# Altium schematic sheet Sheet_X_link.SchDoc
size A4
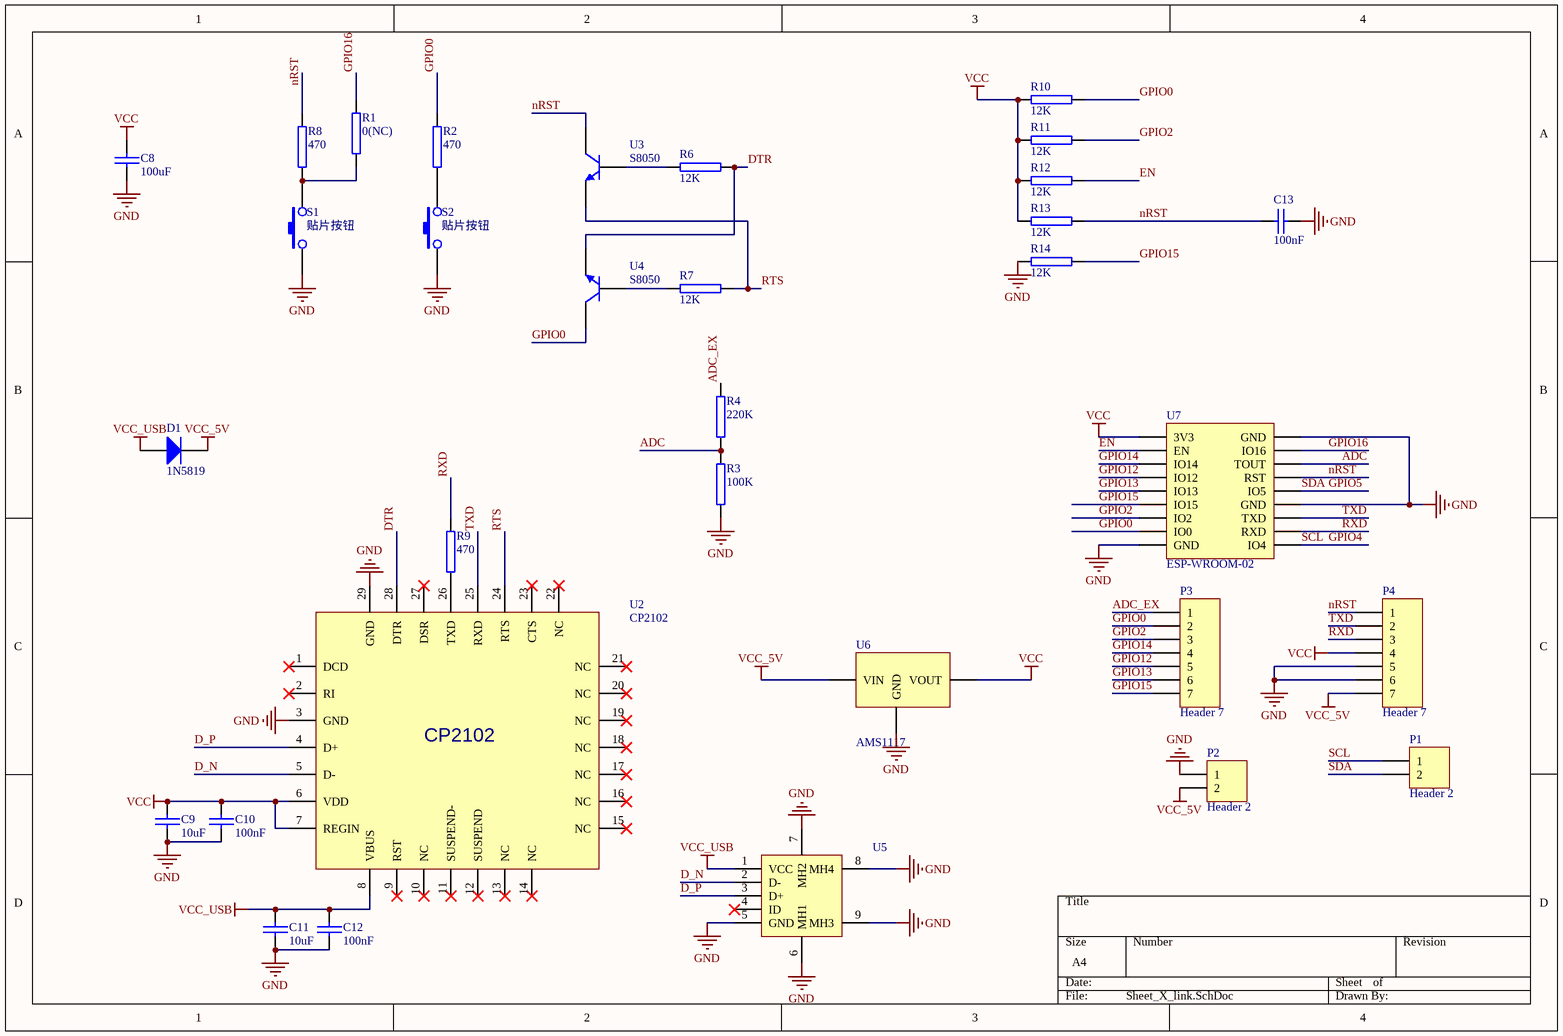
[diagram p0: Sheet_X_link.SchDoc]

## Parts
C8  100uF  [C3528]
C9  10uF  [C0603]
C10  100nF  [C0603]
C11  10uF  [C0603]
C12  100nF  [C0603]
C13  100nF  [C0603]
D1  1N5819  [1n4148]
P1  Header 2  [HDR1X2]
P2  Header 2  [HDR1X2]
P3  Header 7  [HDR1X7]
P4  Header 7  [HDR1X7]
R1  0(NC)  [R0603]
R2  470  [R0603]
R3  100K  [R0603]
R4  220K  [R0603]
R6  12K  [R0603]
R7  12K  [R0603]
R8  470  [R0603]
R9  470  [R0603]
R10  12K  [R0603]
R11  12K  [R0603]
R12  12K  [R0603]
R13  12K  [R0603]
R14  12K  [R0603]
S1  贴片按钮  [switch]
S2  贴片按钮  [switch]
U2  CP2102  [cp2102]
U3  S8050  [s8050]
U4  S8050  [s8050]
U5  MicroUSB-5P  [MICROUSB_5S]  (value not drawn)
U6  AMS1117  [AMS1117]
U7  ESP-WROOM-02  [ESP-WROOM-02]

## Nets
GND: C8.2 C9.1 C10.1 C11.1 C12.1 C13.2 P2.1 P4.5 P4.6 R3.1 R14.1 S1.1 S2.1 U2.3(GND) U2.29(GND) U5.5(GND) U5.6(MH1) U5.7(MH2) U5.8(MH4) U5.9(MH3) U6.1(GND) U7.8(GND) U7.12(GND) U7.17(GND)
VCC: C8.1 C9.2 C10.2 P4.4 R10.1 R11.1 R12.1 R13.1 U2.6(VDD) U2.7(REGIN) U6.2(VOUT) U7.0(3V3)
VCC_5V: D1.2(K) P2.2 P4.7 U6.3(VIN)
VCC_USB: C11.2 C12.2 D1.1(A) U2.8(VBUS) U5.1(VCC)
ADC: R3.2 R4.1 U7.15(TOUT)
ADC_EX: P3.1 R4.2
D_N: U2.5(D-) U5.2(D-)
D_P: U2.4(D+) U5.3(D+)
DTR: R6.2 U2.28(DTR) U4.2(E)
EN: R12.2 U7.1(EN)
GPIO0: P3.2 R2.2 R10.2 U4.3(C) U7.7(IO0)
GPIO2: P3.3 R11.2 U7.6(IO2)
GPIO4: P1.1 U7.9(IO4)  [also labelled SCL]
GPIO5: P1.2 U7.13(IO5)  [also labelled SDA]
GPIO12: P3.5 U7.3(IO12)
GPIO13: P3.6 U7.4(IO13)
GPIO14: P3.4 U7.2(IO14)
GPIO15: P3.7 R14.2 U7.5(IO15)
GPIO16: R1.2 U7.16(IO16)
nRST: C13.1 P4.1 R8.2 R13.2 U3.3(C) U7.14(RST)
RTS: R7.2 U2.24(RTS) U3.2(E)
RXD: P4.3 R9.2 U7.10(RXD)
TXD: P4.2 U2.25(RXD) U7.11(TXD)
NetR1_1: R1.1 R8.1 S1.2
NetR2_1: R2.1 S2.2
NetR6_1: R6.1 U3.1(B)
NetR7_1: R7.1 U4.1(B)
NetR9_1: R9.1 U2.26(TXD)

Not connected (* = marked no-connect by the designer): U2 1(DCD)* 2(RI)* 9(RST)* 10(NC)* 11(SUSPEND-)* 12(SUSPEND)* 13(NC)* 14(NC)* 15(NC)* 16(NC)* 17(NC)* 18(NC)* 19(NC)* 20(NC)* 21(NC)* 22(NC)* 23(CTS)* 27(DSR)*; U5 4(ID)*

## Library data of the parts
C8-C13 = C0603: 贴片电容
D1 = 1N4148: 二极管
P1 P2 = Header 2: Header, 2-Pin; LatestRevisionDate: 17-Jul-2002; LatestRevisionNote: Re-released for DXP Platform.; Publisher: Altium Limited
P3 P4 = Header 7: Header, 7-Pin; LatestRevisionDate: 17-Jul-2002; LatestRevisionNote: Re-released for DXP Platform.; Publisher: Altium Limited
R1-R4 R6-R14 = R0603: 贴片电阻
  R3: value: 100K
S1 S2 = Switch: 3*4*2mm开关
U2 = CP2102: USB转串口芯片
U3 U4 = S8050: 三极管
U5 = MicroUSB_5S: Micro USB插脚
U6 = AMS1117: 3.3V稳压芯片
U7 = ESP-WROOM-02: WiFi芯片